# Altium schematic sheet Sensing.SchDoc
size A
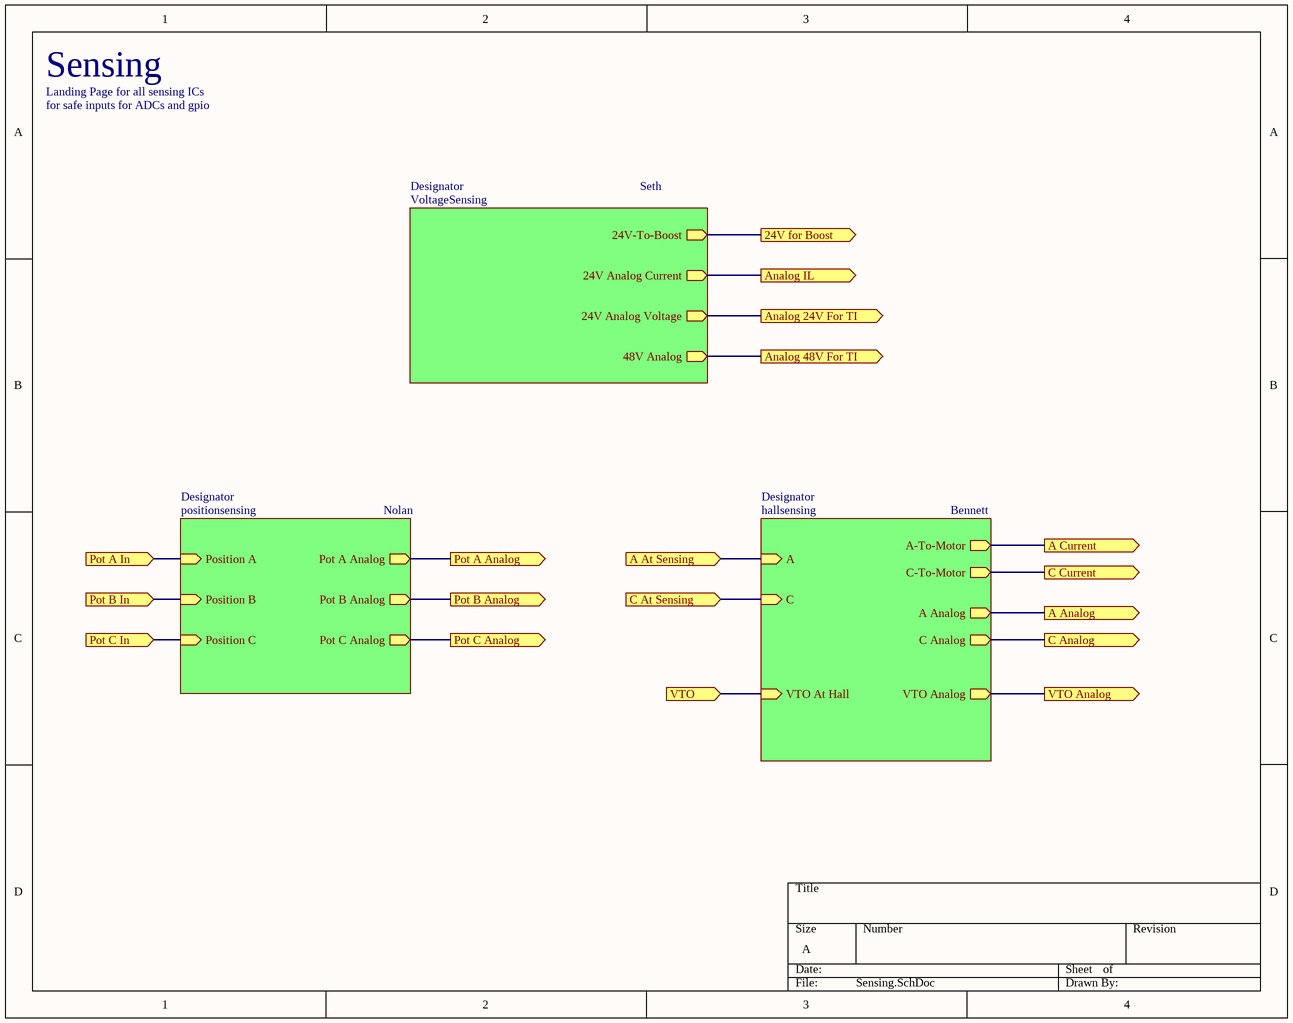
[diagram p0: Sensing.SchDoc]

## Sub-sheets
Designator = VoltageSensing: 24V Analog Current (out), 24V Analog Voltage (out), 24V-To-Boost (out), 48V Analog (out)
Designator = hallsensing: A (in), C (in), A Analog (out), C Analog (out), A-To-Motor (out), C-To-Motor (out), VTO At Hall (in), VTO Analog (out)
Designator = positionsensing: Position A (in), Position B (in), Position C (in), Pot A Analog (out), Pot B Analog (out), Pot C Analog (out)

## Ports
24V for Boost (out), A Analog (out), A At Sensing (in), A Current (out), Analog 24V For TI (out), Analog 48V For TI (out), Analog IL (out), C Analog (out), C At Sensing (in), C Current (out), Pot A Analog (out), Pot A In (in), Pot B Analog (out), Pot B In (in), Pot C Analog (out), Pot C In (in), VTO (in), VTO Analog (out)

## Nets
24V for Boost: port 24V for Boost, sheet Designator/24V-To-Boost
A Analog: port A Analog, sheet Designator/A Analog
A At Sensing: port A At Sensing, sheet Designator/A
A Current: port A Current, sheet Designator/A-To-Motor
Analog 24V For TI: port Analog 24V For TI, sheet Designator/24V Analog Voltage
Analog 48V For TI: port Analog 48V For TI, sheet Designator/48V Analog
Analog IL: port Analog IL, sheet Designator/24V Analog Current
C Analog: port C Analog, sheet Designator/C Analog
C At Sensing: port C At Sensing, sheet Designator/C
C Current: port C Current, sheet Designator/C-To-Motor
Pot A Analog: port Pot A Analog, sheet Designator/Pot A Analog
Pot A In: port Pot A In, sheet Designator/Position A
Pot B Analog: port Pot B Analog, sheet Designator/Pot B Analog
Pot B In: port Pot B In, sheet Designator/Position B
Pot C Analog: port Pot C Analog, sheet Designator/Pot C Analog
Pot C In: port Pot C In, sheet Designator/Position C
VTO: port VTO, sheet Designator/VTO At Hall
VTO Analog: port VTO Analog, sheet Designator/VTO Analog

## Notes on the sheet
- Sensing
- Landing Page for all sensing ICs
- for safe inputs for ADCs and gpio
- Seth
- Nolan
- Bennett